# EAGLE design pc_fdc1004_brk_v3 (EAGLE 9.5.2)
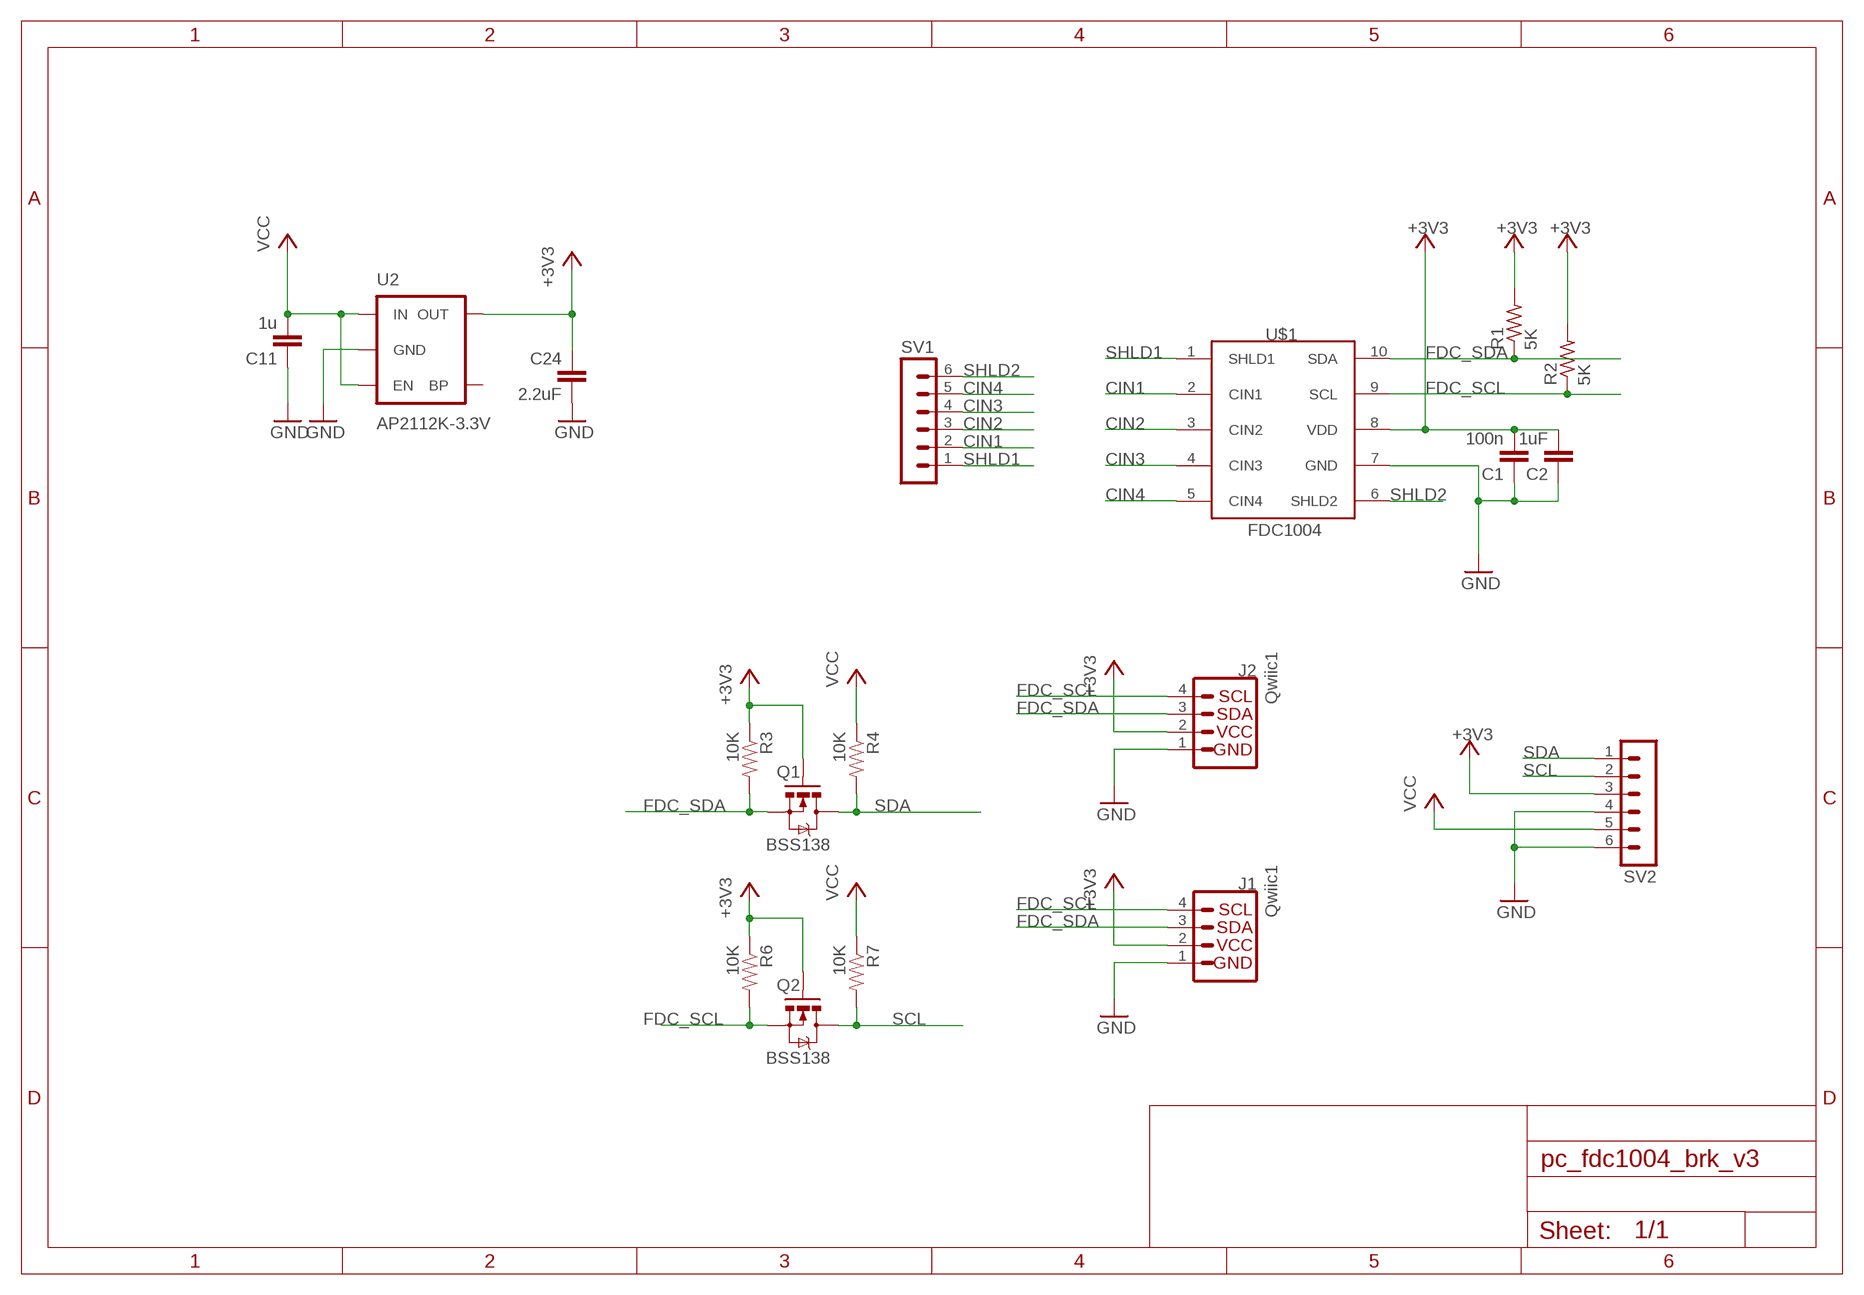
[diagram p0: schematic, sheet 1]

## Parts
C1  100n  C-EUC0805  [C0805]
C2  1uF  C-EUC0805  [C0805]
C11  1u  C-EUC0402  [C0402]
C24  2.2uF  C-EUC0402  [C0402]
J1  Qwiic1  QWIIC_CONNECTORJS-1MM  [1X04_1MM_RA]
J2  Qwiic1  QWIIC_CONNECTORJS-1MM  [1X04_1MM_RA]
Q1  BSS138  MOSFET-NCHANNELSMD  [SOT23-3]
Q2  BSS138  MOSFET-NCHANNELSMD  [SOT23-3]
R1  5K  R-US_R0805  [R0805]
R2  5K  R-US_R0805  [R0805]
R3  10K  RESISTOR0603-RES  [0603-RES]
R4  10K  RESISTOR0603-RES  [0603-RES]
R6  10K  RESISTOR0603-RES  [0603-RES]
R7  10K  RESISTOR0603-RES  [0603-RES]
SV1  MA06-1  [MA06-1]
SV2  MA06-1  [MA06-1]
U2  AP2112K-3.3V  V_REG_LDOSMD  [SOT23-5]
U$1  FDC1004  [VSSOP-10]

## Nets
+3V3: C1.2 C2.2 C24.1 J1.2 J2.2 Q1.1(G) Q2.1(G) R1.2 R2.2 R3.1 R6.1 SV2.3 U2.5(OUT) U$1.8(VDD)
CIN1: SV1.2 U$1.2(CIN1)
CIN2: SV1.3 U$1.3(CIN2)
CIN3: SV1.4 U$1.4(CIN3)
CIN4: SV1.5 U$1.5(CIN4)
FDC_SCL: J1.4 J2.4 Q2.2(S) R2.1 R6.2 U$1.9(SCL)
FDC_SDA: J1.3 J2.3 Q1.2(S) R1.1 R3.2 U$1.10(SDA)
GND [gnd]: C1.1 C2.1 C11.1 C24.2 J1.1 J2.1 SV2.4 SV2.6 U2.2(GND) U$1.7(GND)
SCL: Q2.3(D) R7.2 SV2.2
SDA: Q1.3(D) R4.2 SV2.1
SHLD1: SV1.1 U$1.1(SHLD1)
SHLD2: SV1.6 U$1.6(SHLD2)
VCC: C11.2 R4.1 R7.1 SV2.5 U2.1(IN) U2.3(EN)
Unconnected: U2.4(BP)

## Library data of the parts
C1 C2 C11 C24 = rcl:C-EU: CAPACITOR, European symbol; SPICEPREFIX: C
J1 J2 = SparkFun-Connectors:QWIIC_CONNECTOR: SparkFun I2C Standard Qwiic Connector An SMD 1mm pitch JST connector makes it easy and quick (get it? Qwiic?) to connect I2C devices to each other. The Qwiic system <http://www.sparkfun.com/qwiic> enables fast and solderless connection between popular platforms and various sensors and actuators. We carry 200mm <https://www.sparkfun.com/products/14204>, 100mm <https://www.sparkfun.com/products/14205>, 50mm <https://www.sparkfun.com/products/14206>, and breadboard friendly <https://www.sparkfun.com/products/14207> Qwiic cables. We also offer 10 pcs strips <https://www.sparkfun.com/products/14323> the SMD connectors.; PROD_ID: CONN-13694
Q1 Q2 = SparkFun:MOSFET-NCHANNEL
R1 R2 = rcl:R-US_: RESISTOR, American symbol; SPICEPREFIX: R
R3 R4 R6 R7 = SparkFun:RESISTOR: Resistor Basic schematic elements and footprints for 0603, 1206, and PTH resistors.
SV1 SV2 = con-lstb:MA06-1: PIN HEADER; OC_FARNELL: unknown; OC_NEWARK: unknown
U2 = SparkFun-PowerIC:V_REG_LDO: Voltage Regulator LDO Standard 150mA LDO voltage regulator in SOT-23 layout. Micrel part MIC5205. BP (by-pass) pin is used to lower output noise with 470pF cap.; PROD_ID: VREG-12457
U$1 = circuitects:FDC1004

## Net classes
1 USB: width 0.102 mm, drill 0.1 mm
2 gnd: width 0.102 mm, drill 0.1 mm
3 usbvcc: width 0.102 mm, drill 0.1 mm, clearance 0.15 mm
4 USBpair: width 0.102 mm, drill 0.1 mm, clearance 0.15 mm to class 3

## Board
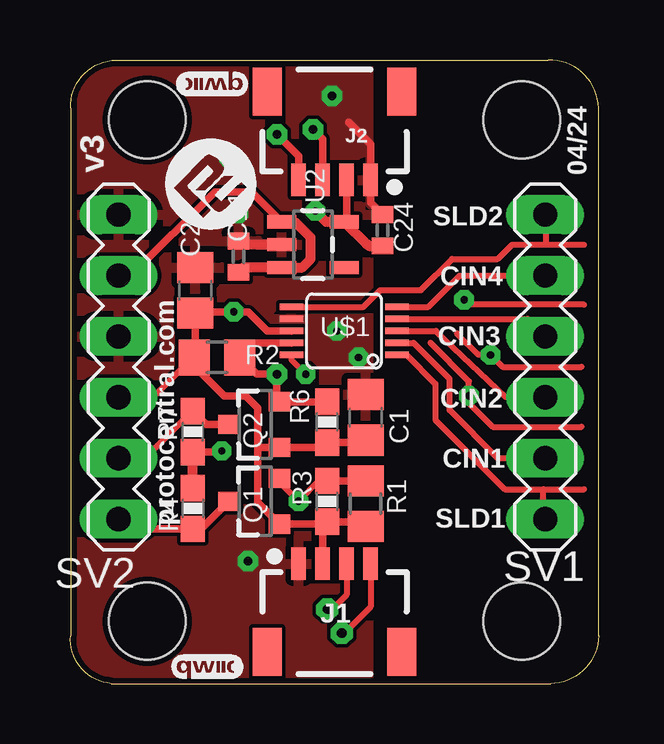
[diagram p1: board, top side]
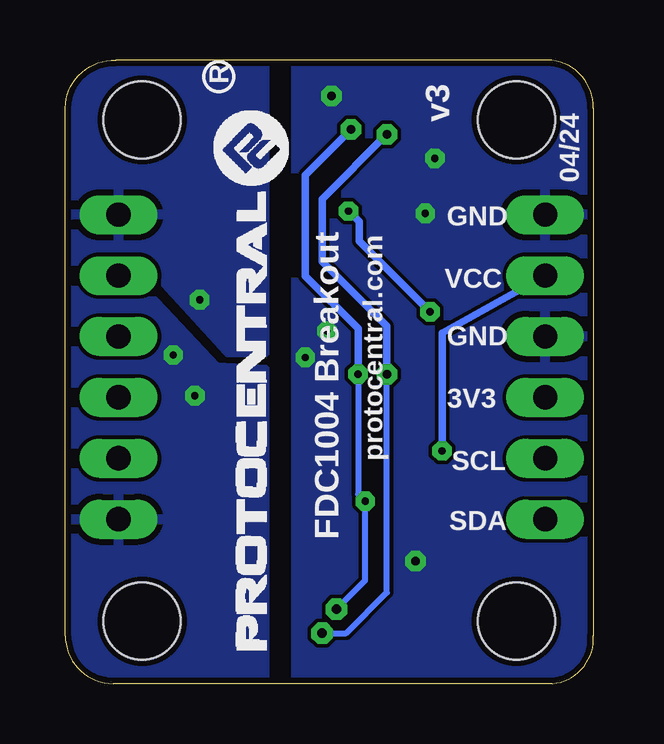
[diagram p2: board, bottom side, seen from below]

Size 22.01 x 26 mm. Coordinates in mm from the lower left corner, seen from the top.
Outline: 1.71,0 20.01,0 arc90 22.01,2 22.01,24 arc90 19.91,26 1.91,26 arc90 0.01,24 0.01,2 arc90 1.71,0
Copper layers (1*16): Top 0.035mm / dielectric 1.5mm / Bottom 0.035mm
Design rules "Circuitects-Rules *": minimum track width 6mil, minimum drill 0.3mm, track to track 6mil, track to pad 6mil, pad to pad 6mil, via to via 6mil, smd to smd 6mil, copper to edge 10mil, drill to drill 8mil, minimum pad ring 12mil, minimum via ring 10mil, stop-mask expansion 4mil, vias tented up to drill 25mil, thermal gap 10mil
Holes 3.2 mm at 18.81,2.6 18.81,23.5 3.21,23.5 3.21,2.6

### Footprints (pad centres in the part's own frame; a part is rotated, then mirrored left to right if it is on the bottom)
C0805 = smd 1.3 x 1.5: 1 -0.95,0; 2 0.95,0
C0402 = smd 0.7 x 0.9: 1 -0.65,0; 2 0.65,0
1X04_1MM_RA = smd 0.6 x 1.35: 1 -1.5,0; 2 -0.5,0; 3 0.5,0; 4 1.5,0 | smd 1.2 x 2: NC1 2.8,-3.675; NC2 -2.8,-3.675
SOT23-3 = smd 0.8 x 0.9: 1 -0.95,-1; 2 0.95,-1; 3 0,1.1
R0805 = smd 1.3 x 1.5: 1 -0.95,0; 2 0.95,0
0603-RES = smd 1.1 x 1: 1 -0.85,0; 2 0.85,0
MA06-1 = drill 1.016 long: 1 -6.35,0; 2 -3.81,0; 3 -1.27,0; 4 1.27,0; 5 3.81,0; 6 6.35,0
SOT23-5 = smd 0.55 x 1.2: 1 -0.95,-1.3; 2 0,-1.3; 3 0.95,-1.3; 4 0.95,1.3; 5 -0.95,1.3
VSSOP-10 = smd 0.27 x 0.975: 1 -1,-2.2; 2 -0.5,-2.2; 3 0,-2.2; 4 0.5,-2.2; 5 1,-2.2; 6 1,2.2; 7 0.5,2.2; 8 0,2.2; 9 -0.5,2.2; 10 -1,2.2

### Placement (x,y rotation side)
C1  12.31,11.1 270 top
C2  5.21,16.4 270 top
C11  7.01,17.8 270 top
C24  13.01,18.9 90 top
J1  11.01,5 0 top
J2  11.01,21 180 top
Q1  7.71,7.6 90 top
Q2  7.71,10.8 90 top
R1  12.31,7.5 270 top
R2  6.11,13.6 180 top
R3  10.71,7.6 90 top
R4  5.11,7.3 270 top
R6  10.71,10.9 90 top
R7  5.11,10.5 90 top
SV1  19.79,13.2 90 top
SV2  2.01,13.2 90 top
U2  10.11,18.3 270 top
U$1  11.41,14.7 90 top
U$2  [QWIIC_3MM]  5.71,0.7 0 top
U$3  [QWIIC_3MM]  5.91,25 180 top
U$4  [PCROUNDLOGO]  9.91,15.3 90 top
U$5  [PCLOG_SMALL_V3]  12.71,1.4 90 bottom

### Tracks (layer width: path | path; a pad name or v marks a point on that pad's centre or on a via)
+3V3  (via drill 0.3)
  Top 0.254: R2.2 5.11,13.6 3.44,11.93 SV2.3
  Top 0.305: C2.2 5.21,13.65 | 5.21,13.65 R2.2 | U$1.8 8.21,14.7 7.41,15.5 v6.81,15.5 5.26,15.5 C2.2 | 5.46,15.2 C2.2 | R3.1 10.61,6.65 Q1.1 | R3.1 12.11,6.75 R1.2 | 8.66,6.7 Q1.1 | 5.21,13.65 5.21,13.2 6.41,12 7.31,12 7.81,11.5 7.81,9.85 | 7.81,9.85 7.81,7.55 Q1.1 | 7.81,9.85 Q2.1 10.51,9.85 R6.1 12.21,10.05 C1.2 | J2.2 11.51,19.35 U2.5 | J1.2 10.51,6.55 R3.1
  Top 0.406: v10.21,19.7 10.66,19.25 U2.5 12.34,18.32 12.45,18.25 C24.1
  Bottom 0.305: v6.81,15.5 9.76,18.45 9.76,19.25 v10.21,19.7
CIN1
  Top 0.254: U$1.2 14.31,14.2 15.81,12.7 15.81,11.4 17.82,9.39 SV1.2
CIN2
  Top 0.254: U$1.3 15.23,14.7 18.16,11.93 SV1.3
CIN3
  Top 0.254: SV1.4 19.06,15.2 U$1.4
CIN4
  Top 0.254: SV1.5 16.22,17.01 14.91,15.7 U$1.5
FDC_SCL  (via drill 0.35, 0.4)
  Top 0.254: J1.4 12.51,3.2 11.41,2.1 v11.31,2.1
  Top 0.305: U$1.9 7.66,14.2 R2.1 7.76,12.9 v8.61,12.9 8.61,11.85 Q2.2 R6.2 | J2.4 9.51,22 v8.61,22.9
  Bottom 0.254: v11.31,2.1 10.31,2.1 8.61,3.8 v8.61,12.9
  Bottom 0.305: v8.61,22.9 11.31,20.2 11.31,17.6 8.61,14.9 v8.61,12.9
FDC_SDA  (via drill 0.3, 0.35, 0.4)
  Top 0.254: U$1.10 9.21,13.5 v9.81,12.9 | R3.2 10.36,8.45 v9.51,7.6 8.71,8.4 Q1.2 | J1.3 11.51,3.7 10.91,3.1 v10.71,3.1
  Top 0.305: R3.2 R1.1 | J2.3 10.51,22.7 v10.11,23.1
  Bottom 0.254: v9.81,12.9 9.81,12.7 9.81,7.9 v9.51,7.6 9.51,4.3 v10.71,3.1
  Bottom 0.305: v10.11,23.1 12.01,21.2 12.01,17 9.81,14.8 9.81,12.7
GND  (via drill 0.3, 0.35)
  Top 0.305: C24.2 12.51,20.05 J2.1 12.51,22.5 11.61,23.4
  Top 0.406: U2.2 7.16,18.3 C11.1
  other vias: 11.11,14.7 12.01,13.6 7.01,19.6 6.61,21.9 7.41,5.1 10.91,24.5
  pour Bottom: 0.01,-0.4 0.01,26.6 12.41,26.6 12.41,-0.4
  pour Top: 0.01,-0.4 0.01,26.6 12.41,26.6 12.41,-0.4
SCL
  Top 0.254: R7.2 5.06,11.35 3.1,9.39 SV2.2
  Top 0.305: Q2.3 5.66,10.8 R7.2
SDA
  Top 0.305: Q1.3 5.46,6.45 R4.2 2.41,6.45 SV2.1
SHLD1  (via drill 0.3)
  Top 0.254: U$1.1 14.01,13.7 15.21,12.5 15.21,11 18.11,8.1 19.71,8.1 | 15.01,14.2 16.61,12.6 v16.61,12 16.61,11.7 17.61,10.7 21.31,10.7 | 16.11,14.6 17.01,13.7 v17.51,13.7 18.01,13.2 21.31,13.2 | 19.71,8.1 21.41,8.1 | SV1.1 19.71,6.93 19.71,8.1
  pour Bottom: 13.71,13.1 13.71,-0.5 22.01,-0.5 22.01,16.6 18.91,16.6 15.71,13.2
SHLD2  (via drill 0.3)
  Top 0.254: 16.21,16 v16.41,16 16.61,15.8 21.41,15.8 | 19.81,18.3 18.41,18.3 17.81,17.7 15.91,17.7 14.61,16.4 12.91,16.4 12.21,15.7 U$1.6 | 19.81,18.3 21.41,18.3 | SV1.6 19.81,19.53 19.81,18.3
  pour Bottom: 13.71,13.8 15.21,13.8 18.51,17.4 22.01,17.4 22.01,26.7 13.71,26.7
VCC  (via drill 0.3)
  Top 0.305: R7.1 6.26,9.65 v6.31,9.7 | U2.1 7.56,20.5 6.01,20.5 2.52,17.01 SV2.5
  Top 0.406: R4.1 R7.1 | U2.1 8.86,19.2 9.41,19.2 10.01,18.6 10.01,17.7 9.66,17.35 U2.3 7.21,17.35 C11.2
  Bottom 0.305: v6.31,9.7 6.31,14.61 SV2.5

### Text on the board
tPlace: v3 | 04/24 | SLD2 | CIN4 | protocentral.com | CIN3 | CIN2 | CIN1 | SLD1
bPlace: v3 | R | 04/24 | GND | protocentral.com | VCC | GND | 3V3 | SCL | SDA | FDC1004 Breakout